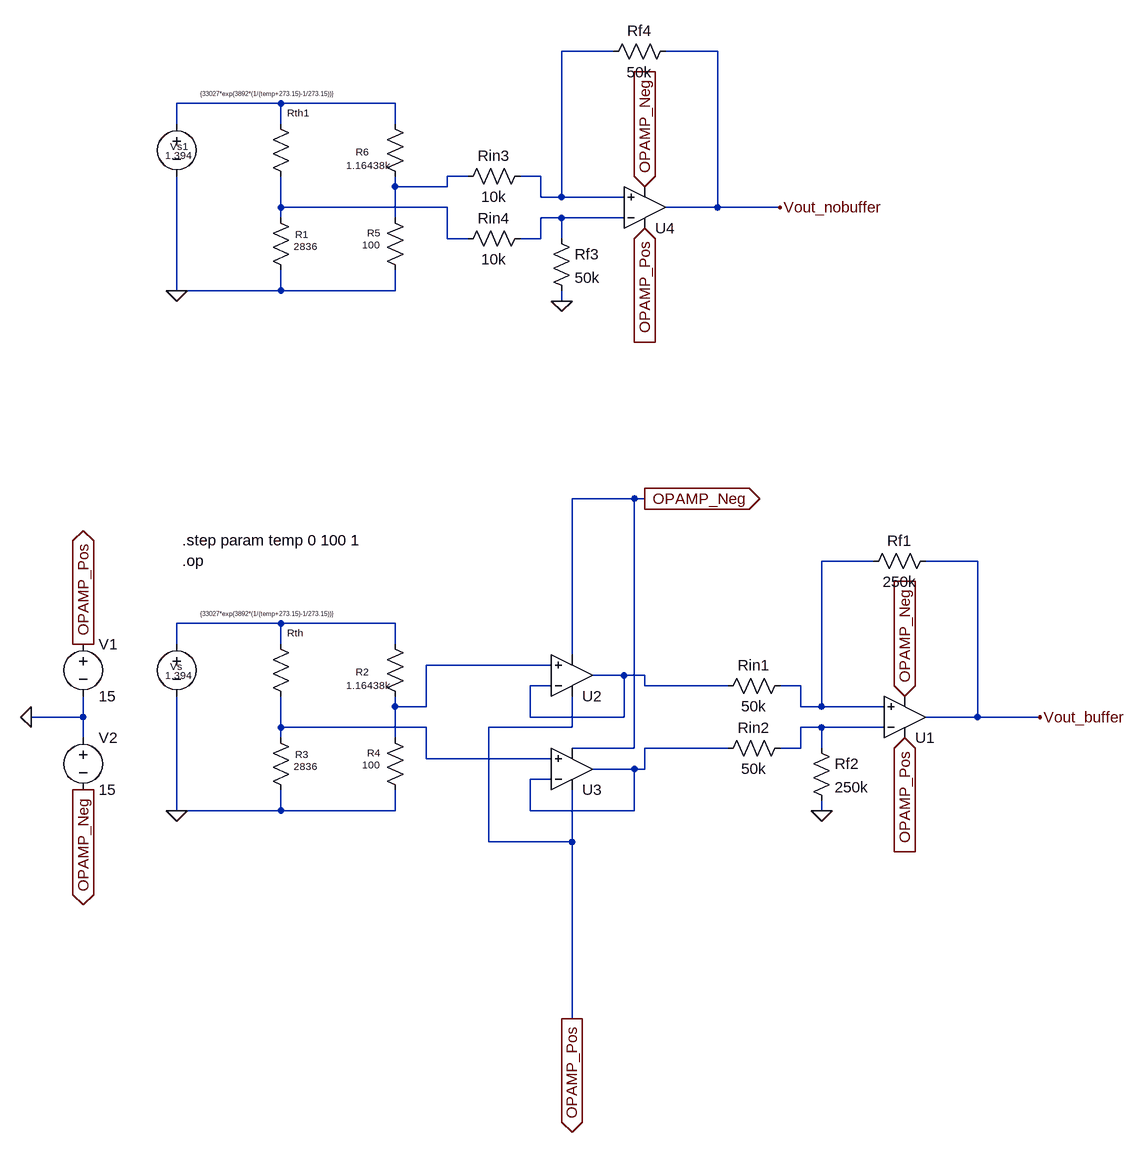
[diagram p0: schematic Instrumentation_Project.asc]
Instrumentation_Project.asc, the LTspice schematic file:
Version 4.1
SHEET 1 1564 824
WIRE 752 -864 672 -864
WIRE 912 -864 832 -864
WIRE 240 -784 80 -784
WIRE 416 -784 240 -784
WIRE 80 -752 80 -784
WIRE 240 -752 240 -784
WIRE 416 -752 416 -784
WIRE 528 -672 496 -672
WIRE 640 -672 608 -672
WIRE 416 -656 416 -672
WIRE 496 -656 496 -672
WIRE 496 -656 416 -656
WIRE 640 -640 640 -672
WIRE 672 -640 672 -864
WIRE 672 -640 640 -640
WIRE 768 -640 672 -640
WIRE 240 -624 240 -672
WIRE 496 -624 240 -624
WIRE 912 -624 912 -864
WIRE 912 -624 832 -624
WIRE 1008 -624 912 -624
WIRE 240 -608 240 -624
WIRE 416 -608 416 -656
WIRE 672 -608 640 -608
WIRE 768 -608 672 -608
WIRE 496 -576 496 -624
WIRE 528 -576 496 -576
WIRE 640 -576 640 -608
WIRE 640 -576 608 -576
WIRE 672 -576 672 -608
WIRE 80 -496 80 -672
WIRE 240 -496 240 -528
WIRE 240 -496 80 -496
WIRE 416 -496 416 -528
WIRE 416 -496 240 -496
WIRE 672 -480 672 -496
WIRE 784 -176 688 -176
WIRE 800 -176 784 -176
WIRE 1152 -80 1072 -80
WIRE 1312 -80 1232 -80
WIRE 240 16 80 16
WIRE 416 16 240 16
WIRE 80 48 80 16
WIRE 240 48 240 16
WIRE 416 48 416 16
WIRE 688 64 688 -176
WIRE 656 80 464 80
WIRE 768 96 720 96
WIRE 800 96 768 96
WIRE 656 112 624 112
WIRE 800 112 800 96
WIRE 928 112 800 112
WIRE 1040 112 1008 112
WIRE 416 144 416 128
WIRE 464 144 464 80
WIRE 464 144 416 144
WIRE 1040 144 1040 112
WIRE 1072 144 1072 -80
WIRE 1072 144 1040 144
WIRE 1168 144 1072 144
WIRE -64 160 -64 128
WIRE -64 160 -144 160
WIRE 624 160 624 112
WIRE 768 160 768 96
WIRE 768 160 624 160
WIRE 1312 160 1312 -80
WIRE 1312 160 1232 160
WIRE 1408 160 1312 160
WIRE 240 176 240 128
WIRE 464 176 240 176
WIRE 688 176 688 128
WIRE 688 176 560 176
WIRE 1072 176 1040 176
WIRE 1168 176 1072 176
WIRE -64 192 -64 160
WIRE 240 192 240 176
WIRE 416 192 416 144
WIRE 784 208 784 -176
WIRE 784 208 688 208
WIRE 928 208 800 208
WIRE 1040 208 1040 176
WIRE 1040 208 1008 208
WIRE 1072 208 1072 176
WIRE 464 224 464 176
WIRE 656 224 464 224
WIRE 784 240 720 240
WIRE 800 240 800 208
WIRE 800 240 784 240
WIRE 656 256 624 256
WIRE 80 304 80 128
WIRE 240 304 240 272
WIRE 240 304 80 304
WIRE 416 304 416 272
WIRE 416 304 240 304
WIRE 624 304 624 256
WIRE 784 304 784 240
WIRE 784 304 624 304
WIRE 1072 304 1072 288
WIRE 560 352 560 176
WIRE 688 352 688 272
WIRE 688 352 560 352
WIRE 688 624 688 352
FLAG 80 304 0
FLAG -64 48 OPAMP_Pos
IOPIN -64 48 Out
FLAG 1200 128 OPAMP_Neg
IOPIN 1200 128 In
FLAG 1200 192 OPAMP_Pos
IOPIN 1200 192 In
FLAG -144 160 0
FLAG -64 272 OPAMP_Neg
IOPIN -64 272 Out
FLAG 1072 304 0
FLAG 1408 160 Vout_buffer
FLAG 688 624 OPAMP_Pos
IOPIN 688 624 Out
FLAG 800 -176 OPAMP_Neg
IOPIN 800 -176 Out
FLAG 80 -496 0
FLAG 800 -656 OPAMP_Neg
IOPIN 800 -656 In
FLAG 800 -592 OPAMP_Pos
IOPIN 800 -592 In
FLAG 672 -480 0
FLAG 1008 -624 Vout_nobuffer
SYMBOL res 224 176 R0
WINDOW 0 38 41 Left 1
WINDOW 3 36 60 Left 1
SYMATTR InstName R3
SYMATTR Value 2836
SYMBOL res 400 176 R0
WINDOW 0 -27 39 Left 1
WINDOW 3 -35 57 Left 1
SYMATTR InstName R4
SYMATTR Value 100
SYMBOL res 400 32 R0
WINDOW 0 -45 58 Left 1
WINDOW 3 -59 79 Left 1
SYMATTR InstName R2
SYMATTR Value 1.16438k
SYMBOL voltage 80 32 R0
WINDOW 0 -10 50 Left 1
WINDOW 3 -18 64 Left 1
WINDOW 123 0 0 Left 0
WINDOW 39 0 0 Left 0
SYMATTR InstName Vs
SYMATTR Value 1.394
SYMBOL res 224 32 R0
WINDOW 0 26 -2 Left 1
WINDOW 3 -108 -31 Left 0
SYMATTR InstName Rth
SYMATTR Value {33027*exp(3892*(1/(temp+273.15)-1/273.15))}
SYMBOL res 1024 96 R90
WINDOW 0 0 56 VBottom 2
WINDOW 3 32 56 VTop 2
SYMATTR InstName Rin1
SYMATTR Value 50k
SYMBOL res 1024 192 R90
WINDOW 0 0 56 VBottom 2
WINDOW 3 32 56 VTop 2
SYMATTR InstName Rin2
SYMATTR Value 50k
SYMBOL res 1056 192 R0
SYMATTR InstName Rf2
SYMATTR Value 250k
SYMBOL res 1248 -96 R90
WINDOW 0 0 56 VBottom 2
WINDOW 3 32 56 VTop 2
SYMATTR InstName Rf1
SYMATTR Value 250k
SYMBOL voltage -64 32 R0
WINDOW 123 0 0 Left 0
WINDOW 39 0 0 Left 0
SYMATTR InstName V1
SYMATTR Value 15
SYMBOL voltage -64 176 R0
WINDOW 123 0 0 Left 0
WINDOW 39 0 0 Left 0
SYMATTR InstName V2
SYMATTR Value 15
SYMBOL OpAmps\\UniversalOpAmp2 1200 160 M180
SYMATTR InstName U1
SYMBOL OpAmps\\UniversalOpAmp2 688 96 M180
SYMATTR InstName U2
SYMBOL OpAmps\\UniversalOpAmp2 688 240 M180
SYMATTR InstName U3
SYMBOL res 224 -624 R0
WINDOW 0 38 41 Left 1
WINDOW 3 36 60 Left 1
SYMATTR InstName R1
SYMATTR Value 2836
SYMBOL res 400 -624 R0
WINDOW 0 -27 39 Left 1
WINDOW 3 -35 57 Left 1
SYMATTR InstName R5
SYMATTR Value 100
SYMBOL res 400 -768 R0
WINDOW 0 -45 58 Left 1
WINDOW 3 -59 79 Left 1
SYMATTR InstName R6
SYMATTR Value 1.16438k
SYMBOL voltage 80 -768 R0
WINDOW 0 -10 50 Left 1
WINDOW 3 -18 64 Left 1
WINDOW 123 0 0 Left 0
WINDOW 39 0 0 Left 0
SYMATTR InstName Vs1
SYMATTR Value 1.394
SYMBOL res 224 -768 R0
WINDOW 0 26 -2 Left 1
WINDOW 3 -108 -31 Left 0
SYMATTR InstName Rth1
SYMATTR Value {33027*exp(3892*(1/(temp+273.15)-1/273.15))}
SYMBOL res 624 -688 R90
WINDOW 0 0 56 VBottom 2
WINDOW 3 32 56 VTop 2
SYMATTR InstName Rin3
SYMATTR Value 10k
SYMBOL res 624 -592 R90
WINDOW 0 0 56 VBottom 2
WINDOW 3 32 56 VTop 2
SYMATTR InstName Rin4
SYMATTR Value 10k
SYMBOL res 656 -592 R0
SYMATTR InstName Rf3
SYMATTR Value 50k
SYMBOL res 848 -880 R90
WINDOW 0 0 56 VBottom 2
WINDOW 3 32 56 VTop 2
SYMATTR InstName Rf4
SYMATTR Value 50k
SYMBOL OpAmps\\UniversalOpAmp2 800 -624 M180
SYMATTR InstName U4
TEXT 88 -112 Left 2 !.step param temp 0 100 1\n.op

The netlist it stands for:
* Instrumentation_Project.asc
R3 N010 0 2836
R4 N008 0 100
R2 N007 N008 1.16438k
Vs N007 0 1.394
Rth N007 N010 {33027*exp(3892*(1/(temp+273.15)-1/273.15))}
Rin1 N006 N009 50k
Rin2 N011 N012 50k
Rf2 N011 0 250k
Rf1 Vout_buffer N006 250k
V1 OPAMP_Pos 0 15
V2 0 OPAMP_Neg 15
X§U1 N006 N011 OPAMP_Pos OPAMP_Neg Vout_buffer level2 Avol=1Meg GBW=10Meg Slew=10Meg Ilimit=25m Rail=0 Vos=0 En=0 Enk=0 In=0 Ink=0 Rin=500Meg  ; pins In+ In- V+ V- OUT
X§U2 N008 N009 OPAMP_Pos OPAMP_Neg N009 level2 Avol=1Meg GBW=10Meg Slew=10Meg Ilimit=25m Rail=0 Vos=0 En=0 Enk=0 In=0 Ink=0 Rin=500Meg  ; pins In+ In- V+ V- OUT
X§U3 N010 N012 OPAMP_Pos OPAMP_Neg N012 level2 Avol=1Meg GBW=10Meg Slew=10Meg Ilimit=25m Rail=0 Vos=0 En=0 Enk=0 In=0 Ink=0 Rin=500Meg  ; pins In+ In- V+ V- OUT
R1 N004 0 2836
R5 N003 0 100
R6 N002 N003 1.16438k
Vs1 N002 0 1.394
Rth1 N002 N004 {33027*exp(3892*(1/(temp+273.15)-1/273.15))}
Rin3 N001 N003 10k
Rin4 N005 N004 10k
Rf3 N005 0 50k
Rf4 Vout_nobuffer N001 50k
X§U4 N001 N005 OPAMP_Pos OPAMP_Neg Vout_nobuffer level2 Avol=1Meg GBW=10Meg Slew=10Meg Ilimit=25m Rail=0 Vos=0 En=0 Enk=0 In=0 Ink=0 Rin=500Meg  ; pins In+ In- V+ V- OUT
.step param temp 0 100 1
.op
.lib UniversalOpAmp2.lib
.backanno
.end

* Results of the author's LTspice run, read from the files saved beside the schematic
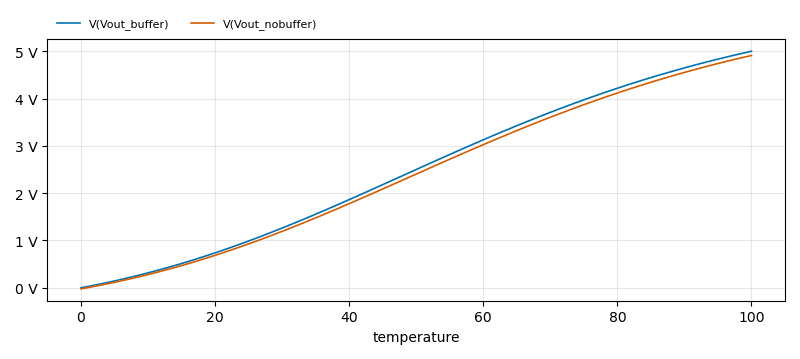
[diagram p1: Operating Point of Instrumentation_Project.asc, plotted from the saved traces]
* Operating Point, 1 run:
*   V(Vout_buffer): -82.45 µV at temperature=0, 4.999 V at temperature=100 , min -82.45 µV, max 4.999 V
*   V(Vout_nobuffer): -22.06 mV at temperature=0, 4.91 V at temperature=100 , min -22.06 mV, max 4.91 V
* From the log:
*   Semiconductor Device Operating Points:
*                           --- Diodes ---
*   Name:     u1:D1       u1:D2       u2:D1       u2:D2       u3:D1
*   Model:      x           x           x           x           x
*   Id:     -1.50e-11   -1.50e-11   -1.49e-11   -1.51e-11   -1.49e-11
*   Vd:     -1.50e+01   -1.50e+01   -1.49e+01   -1.51e+01   -1.49e+01
*   Req:     1.00e-12    1.00e-12    1.00e-12    1.00e-12    1.00e-12
*   CAP:     0.00e+00    0.00e+00    0.00e+00    0.00e+00    0.00e+00
*   Name:     u3:D2       u4:D1       u4:D2
*   Model:      x           x           x
*   Id:     -1.51e-11   -1.50e-11   -1.50e-11
*   Vd:     -1.51e+01   -1.50e+01   -1.50e+01
*   Req:     1.00e-12    1.00e-12    1.00e-12
*   CAP:     0.00e+00    0.00e+00    0.00e+00